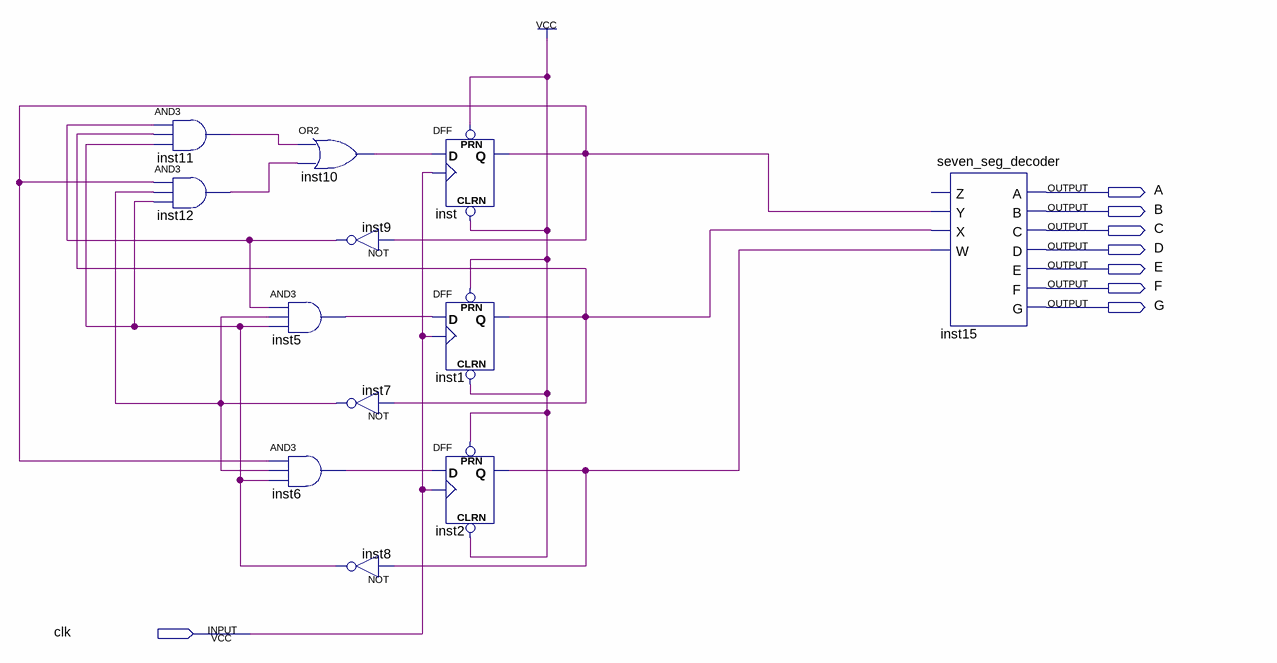
[diagram p0: schematic sheet]
// Quartus schematic step2.bdf as structural Verilog: 12 symbols, 8 pins
module step2 (
  input  clk,
  output A,
  output B,
  output C,
  output D,
  output E,
  output F,
  output G
);

  wire inst1_q, inst2_q, inst5_out, inst6_out, inst7_out, inst8_out, inst9_out, inst10_out, inst11_out,
       inst12_out, inst_q;

  and inst11 (inst11_out, inst9_out, inst1_q, inst8_out);
  and inst12 (inst12_out, inst_q, inst7_out, inst8_out);
  or inst10 (inst10_out, inst11_out, inst12_out);
  and inst5 (inst5_out, inst9_out, inst7_out, inst8_out);
  and inst6 (inst6_out, inst_q, inst7_out, inst8_out);
  not inst9 (inst9_out, inst_q);
  not inst7 (inst7_out, inst1_q);
  not inst8 (inst8_out, inst2_q);
  DFF inst (.CLRN(1'b1), .CLK(clk), .D(inst10_out), .PRN(1'b1), .Q(inst_q));
  DFF inst1 (.CLRN(1'b1), .CLK(clk), .D(inst5_out), .PRN(1'b1), .Q(inst1_q));
  DFF inst2 (.CLRN(1'b1), .CLK(clk), .D(inst6_out), .PRN(1'b1), .Q(inst2_q));
  seven_seg_decoder inst15 (
    .Y(inst_q), .X(inst1_q), .W(inst2_q), .A(A), .B(B), .C(C), .D(D), .E(E), .F(F), .G(G));  // open: Z
endmodule
